# EAGLE design untitled (EAGLE 9.3.0)
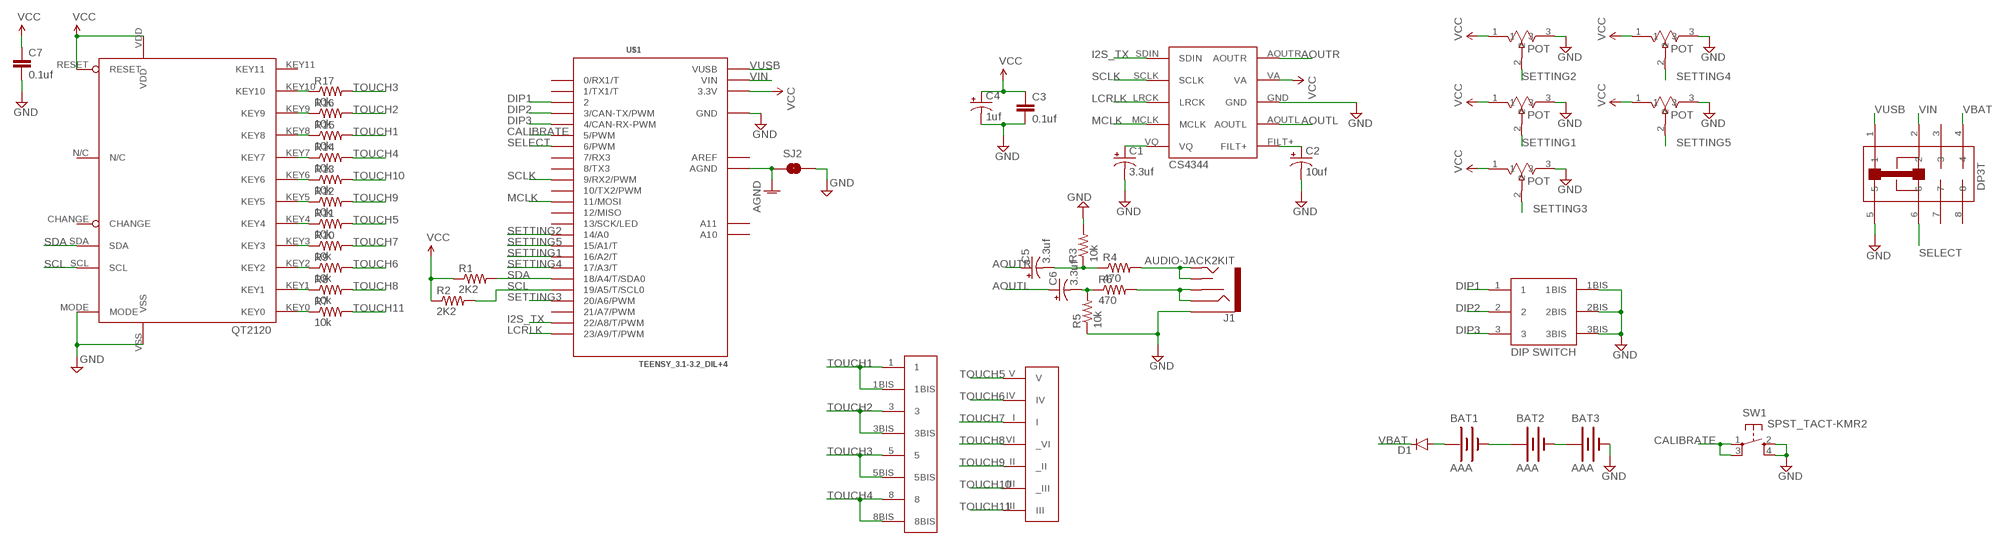
[diagram p0: schematic, sheet 1]

## Parts
BAT1  AAA  BATTERYAAA-KIT  [BATTERY-AAA-KIT]
BAT2  AAA  BATTERYAAA-KIT  [BATTERY-AAA-KIT]
BAT3  AAA  BATTERYAAA-KIT  [BATTERY-AAA-KIT]
C1  3.3uf  CAP_POL1206  [EIA3216]
C2  10uf  CAP_POL1206  [EIA3216]
C3  0.1uf  CAP1206  [1206]
C4  1uf  CAP_POL1206  [EIA3216]
C5  3.3uf  CAP_POL1206  [EIA3216]
C6  3.3uf  CAP_POL1206  [EIA3216]
C7  0.1uf  CAP1206  [1206]
D1  DIODESOD123  [SOD-123]
DIP1  SDA03H1BD  [SDA03H1BD]
DP3T1  OS203012MU5QP1  [OS203012MU5QP1]
J1  AUDIO-JACK2KIT  [AUDIO-JACK-KIT]
POT2  PTV09A-4020U-B104  [PTV09A-4020U-B104]
POT3  PTV09A-4020U-B104  [PTV09A-4020U-B104]
POT5  PTV09A-4020U-B104  [PTV09A-4020U-B104]
R1  2K2  RESISTOR1206  [1206]
R2  2K2  RESISTOR1206  [1206]
R3  10k  RESISTOR1206  [1206]
R4  470  RESISTOR1206  [1206]
R5  10k  RESISTOR1206  [1206]
R6  470  RESISTOR1206  [1206]
R7  10k  RESISTOR1206  [1206]
R8  10k  RESISTOR1206  [1206]
R9  10k  RESISTOR1206  [1206]
R10  10k  RESISTOR1206  [1206]
R11  10k  RESISTOR1206  [1206]
R12  10k  RESISTOR1206  [1206]
R13  10k  RESISTOR1206  [1206]
R14  10k  RESISTOR1206  [1206]
R15  10k  RESISTOR1206  [1206]
R16  10k  RESISTOR1206  [1206]
R17  10k  RESISTOR1206  [1206]
SJ2  JUMPER-PAD-2-NC_BY_TRACE  [PAD-JUMPER-2-NC_BY_TRACE_YES_SILK]
SW1  SPST_TACT-KMR2  [KMR2]
SWEEP  PTV09A-4020U-B104  [PTV09A-4020U-B104]
U1  CS4344  [CS4344]
U$1  TEENSY_3.1-3.2_DIL+4  [TEENSY_3.0-3.2&LC_DIL+4]
U$2  QT2120  [QT2120]
U$4  NOTEPAD  [NOTEPAD]
U$5  CHORDPAD  [CHORDPAD]
VOLUME  PTV09A-4020U-B104  [PTV09A-4020U-B104]

## Nets
AGND: SJ2.1 U$1.AGND
AOUTL: C6.A(+) U1.AOUTL
AOUTR: C5.A(+) U1.AOUTR
CALIBRATE: SW1.1(P) SW1.3(P1) U$1.5(5/PWM)
DIP1: DIP1.1 U$1.2
DIP2: DIP1.2 U$1.3(3/CAN-TX/PWM)
DIP3: DIP1.3 U$1.4(4/CAN-RX-PWM)
GND: BAT3.GND@1(-) C1.C(-) C2.C(-) C3.2 C4.C(-) C7.2 DIP1.1BIS DIP1.2BIS DIP1.3BIS DP3T1.5 J1.SLEEVE POT2.3 POT3.3 POT5.3 R3.2 R5.1 SJ2.2 SW1.2(S) SW1.4(S1) SWEEP.3 U1.GND U$1.GND U$2.MODE U$2.VSS VOLUME.3
I2S_TX: U1.SDIN U$1.22/A8(22/A8/T/PWM)
LCRLK: U1.LRCK U$1.23/A9(23/A9/T/PWM)
LEFT: J1.TIP J1.TSH R4.2
MCLK: U1.MCLK U$1.11(11/MOSI)
N$1: BAT1.GND@1(-) BAT2.PWR@1(+)
N$2: C1.A(+) U1.VQ
N$3: BAT2.GND@1(-) BAT3.PWR@1(+)
N$4: C2.A(+) U1.FILT+
N$5: C5.C(-) R3.1 R4.1
N$6: C6.C(-) R5.2 R6.1
N$7: R17.1 U$2.KEY10
N$8: R16.1 U$2.KEY9
N$9: R15.1 U$2.KEY8
N$10: R14.1 U$2.KEY7
N$11: R13.1 U$2.KEY6
N$12: R12.1 U$2.KEY5
N$13: R11.1 U$2.KEY4
N$14: R10.1 U$2.KEY3
N$15: BAT1.PWR@1(+) D1.A
N$16: R9.1 U$2.KEY2
N$17: R8.1 U$2.KEY1
N$18: R7.1 U$2.KEY0
N$24: J1.RING J1.RSH R6.2
SCL: R2.2 U$1.19/A5(19/A5/T/SCL0) U$2.SCL
SCLK: U1.SCLK U$1.9(9/RX2/PWM)
SDA: R1.2 U$1.18/A4(18/A4/T/SDA0) U$2.SDA
SELECT: DP3T1.6 U$1.6(6/PWM)
SETTING1: POT2.2 U$1.16/A2(16/A2/T)
SETTING2: U$1.14/A0 VOLUME.2
SETTING3: POT3.2 U$1.20/A6(20/A6/PWM)
SETTING4: SWEEP.2 U$1.17/A3(17/A3/T)
SETTING5: POT5.2 U$1.15/A1(15/A1/T)
TOUCH1: R15.2 U$4.1 U$4.1BIS
TOUCH2: R16.2 U$4.3 U$4.3BIS
TOUCH3: R17.2 U$4.5 U$4.5BIS
TOUCH4: R14.2 U$4.8 U$4.8BIS
TOUCH5: R11.2 U$5.V
TOUCH6: R9.2 U$5.IV
TOUCH7: R10.2 U$5.I
TOUCH8: R8.2 U$5._VI
TOUCH9: R12.2 U$5._II
TOUCH10: R13.2 U$5._III
TOUCH11: R7.2 U$5.III
VBAT: D1.C DP3T1.4
VCC: C3.1 C4.A(+) C7.1 POT2.1 POT3.1 POT5.1 R1.1 R2.1 SWEEP.1 U1.VA U$1.3.3V U$2.RESET U$2.VDD VOLUME.1
VIN: DP3T1.2 U$1.VIN
VUSB: DP3T1.1 U$1.VUSB
Unconnected: DP3T1.3 DP3T1.7 DP3T1.8 U$1.0(0/RX1/T) U$1.1(1/TX1/T) U$1.7(7/RX3) U$1.8(8/TX3) U$1.10(10/TX2/PWM) U$1.12(12/MISO) U$1.13(13/SCK/LED) U$1.21/A7(21/A7/PWM) U$1.A10 U$1.A11 U$2.CHANGE U$2.KEY11 U$2.N/C

## Power pins joined to a net without a drawn wire
AREF: U$1.AREF

## Library data of the parts
BAT1-BAT3 = SparkFun-Electromechanical:BATTERY: Battery Holders Various common sizes : AA, AAA, 18650 (PRT-12895), 20mm coin cell and 12mm coin cell. 20MM_4LEGS, BATT-10373; PROD_ID: BATT-08571
C1 C2 = SparkFun-Capacitors:CAP_POL: Capacitor Polarized These are standard SMD and PTH capacitors. Normally 10uF, 47uF, and 100uF in electrolytic and tantalum varieties. Always verify the external diameter of the through hole cap, it varies with capacity, voltage, and manufacturer. The EIA devices should be standard.
C3 C7 = SparkFun-Capacitors:CAP: Capacitor Standard 0603 ceramic capacitor, and 0.1" leaded capacitor.
C4-C6 = SparkFun-Passives:CAP_POL: Capacitor Polarized These are standard SMD and PTH capacitors. Normally 10uF, 47uF, and 100uF in electrolytic and tantalum varieties. Always verify the external diameter of the through hole cap, it varies with capacity, voltage, and manufacturer. The EIA devices should be standard.
D1 = SparkFun-DiscreteSemi:DIODE: Diode These are standard reverse protection diodes and small signal diodes. SMA package can handle up to about 1A. SOD-323 can handle about 200mA. What the SOD-323 package when ordering, there are some mfgs out there that are 5-pin packages.
DIP1 = synthetica:SDA03H1BD
DP3T1 = synthetica:OS203012MU5QP1: A DP3T SWITCH. 3 position, one common out for two rows
J1 = SparkFun-Connectors:AUDIO-JACK2: Stereo audio jack with bypass switches. SMT version used on LilyPad MP3 board.; PROD_ID: CONN-08774
POT2 POT3 POT5 SWEEP VOLUME = synthetica:PTV09A-4020U-B104
R1-R17 = SparkFun-Passives:RESISTOR: Resistor Basic schematic elements and footprints for 0603, 1206, and PTH resistors.
SJ2 = SparkFun-Passives:JUMPER-PAD-2-NC_BY_TRACE
SW1 = adafruit:SPST_TACT: SMT 6mm switch, EVQQ2 series http://www.ladyada.net/library/eagle
U1 = synthetica:CS4344
U$1 = Teensy_3_and_LC_Series_Boards_v1.4:TEENSY_3.1-3.2_DIL+4: Teensy 3.1 and 3.2 in a DIL package with the inner 4 pins
U$2 = synthetica:QT2120
U$4 = synthetica:NOTEPAD
U$5 = synthetica:CHORDPAD

## Board
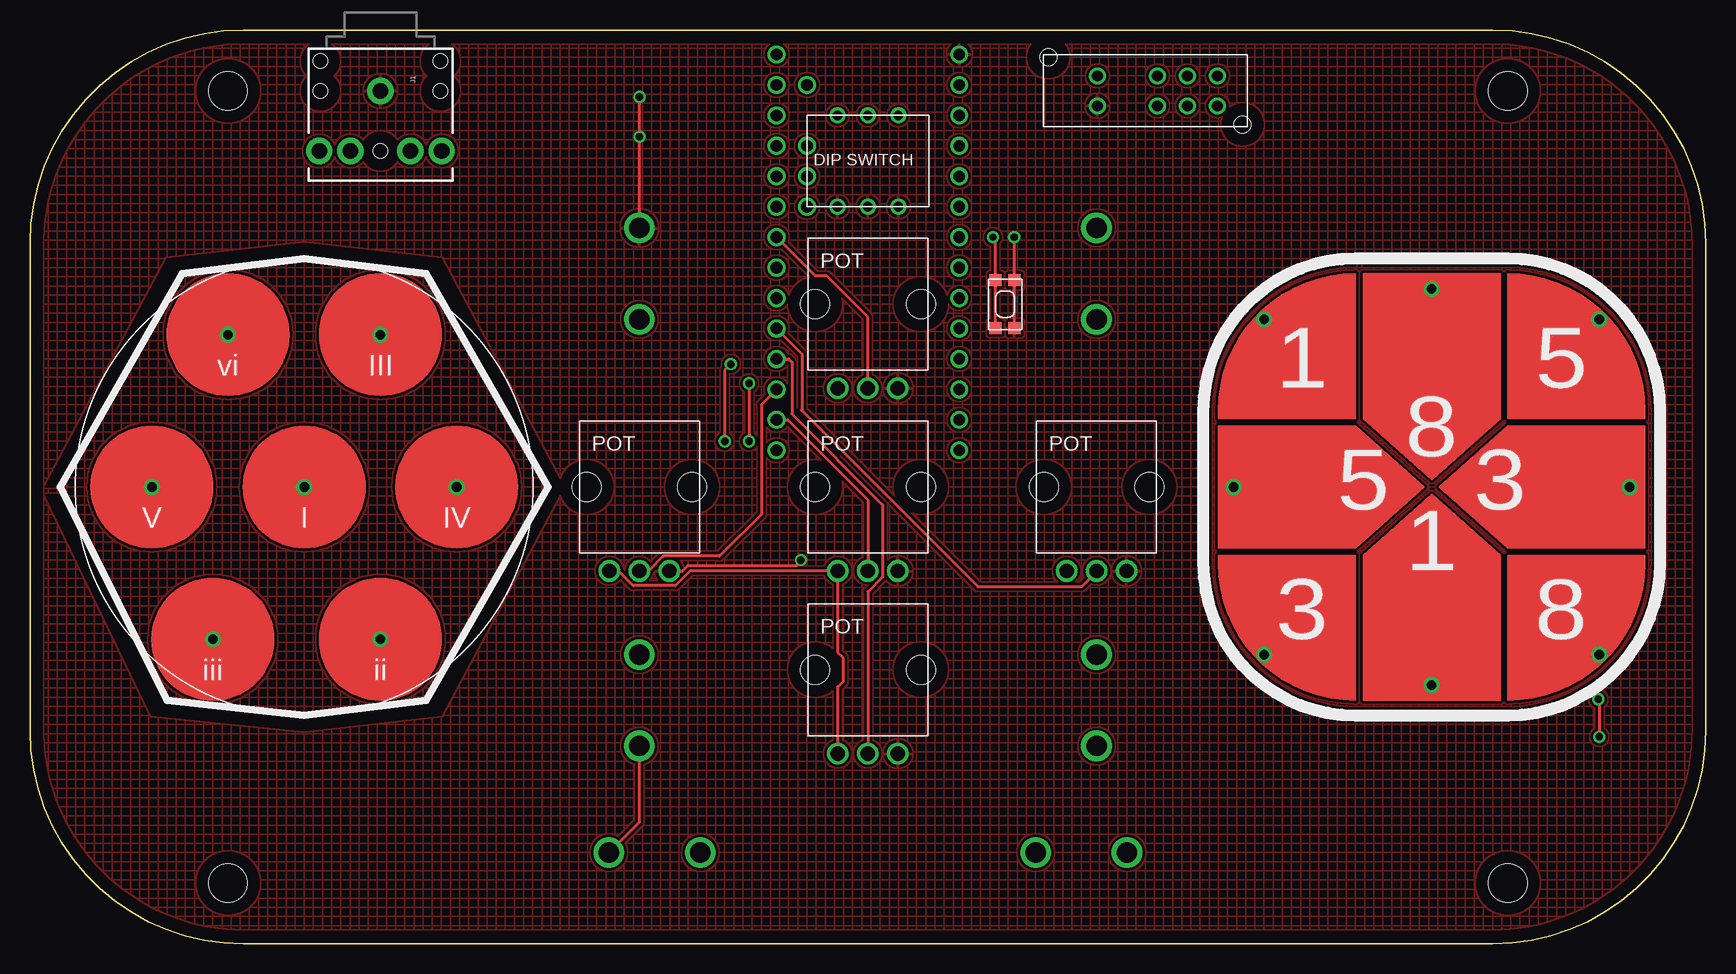
[diagram p1: board, top side]
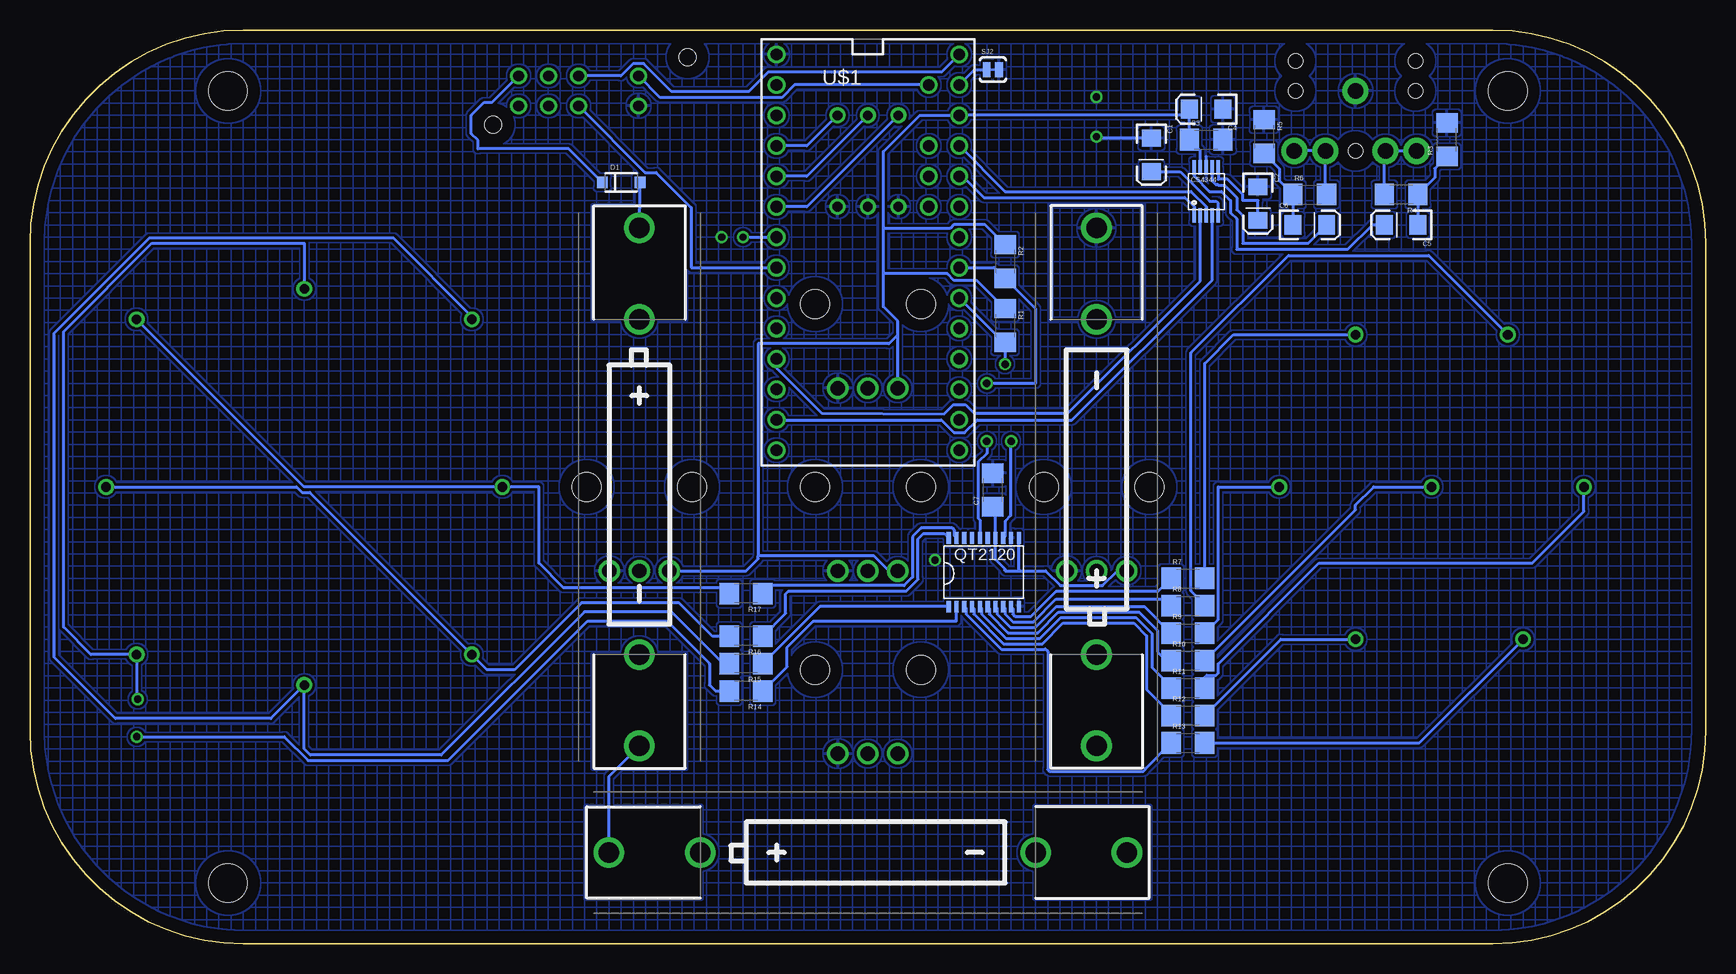
[diagram p2: board, bottom side, seen from below]

Size 139.7 x 76.2 mm. Coordinates in mm from the lower left corner, seen from the top.
Outline: 0,58.42 arc-90 17.78,76.2 121.92,76.2 arc-90 139.7,58.42 139.7,17.78 arc-90 121.92,0 17.78,0 arc-90 0,17.78 0,58.42
Copper layers (1*16): Top 0.035mm / dielectric 1.5mm / Bottom 0.035mm
Design rules "default": minimum track width 10mil, minimum drill 24mil, track to track 8mil, track to pad 8mil, pad to pad 8mil, via to via 8mil, smd to smd 8mil, copper to edge 40mil, drill to drill 8mil, minimum pad ring 10mil, minimum via ring 8mil, stop-mask expansion 4mil, vias tented up to drill 0mil, thermal gap 10mil
Holes 3.2 mm at 16.51,71.12 16.51,5.08 123.19,71.12 123.19,5.08

### Footprints (pad centres in the part's own frame; a part is rotated, then mirrored left to right if it is on the bottom)
BATTERY-AAA-KIT = drill 1.702: GND@1 21.59,0; GND@2 13.97,0; PWR@1 -21.59,0; PWR@2 -13.97,0
EIA3216 = smd 1.4 x 1.6: A 1.4,0; C -1.4,0
1206 = smd 1.6 x 1.8: 1 -1.4,0; 2 1.4,0
SOD-123 = smd 0.9 x 0.95: A 1.575,0; C -1.575,0
SDA03H1BD = drill 0.8: 1 -2.54,-3.81; 1BIS -2.54,3.81; 2 0,-3.81; 2BIS 0,3.81; 3 2.54,-3.81; 3BIS 2.54,3.81
OS203012MU5QP1 = drill 0.9: 1 -5,1.25; 2 0,1.25; 3 2.5,1.25; 4 5,1.25; 5 -5,-1.25; 6 0,-1.25; 7 2.5,-1.25; 8 5,-1.25 | hole 1.4: -9.1,2.8; 7.1,-2.8
AUDIO-JACK-KIT = drill 1.3 pad 2.184: RING 5,5.1; RSH 5,2.5; SLEEVE 0,0; TIP 5,-5.1; TSH 5,-2.5 | hole 1.2: 0,5; -2.5,5; -2.5,-5; 0,-5; 5,0
PTV09A-4020U-B104 = drill 1.2: 1 -2.5,-7; 2 0,-7; 3 2.5,-7 | hole 2.4: -4.4,0; 4.4,0
PAD-JUMPER-2-NC_BY_TRACE_YES_SILK = smd 0.635 x 1.27: 1 -0.508,0; 2 0.508,0
KMR2 = smd 1 x 1: 1 2,0.8; 2 2,-0.8; 3 -2,0.8; 4 -2,-0.8
CS4344 = smd 0.3 x 1.2: AOUTL 0.5,2; AOUTR -1,2; FILT+ 1,2; GND 0,2; LRCK 0,-2; MCLK 0.5,-2; SCLK -0.5,-2; SDIN -1,-2; VA -0.5,2; VQ 1,-2
TEENSY_3.0-3.2&LC_DIL+4 = drill 0.965: 0 -7.62,13.97; 1 -7.62,11.43; 2 -7.62,8.89; 3 -7.62,6.35; 3.3V 7.62,11.43; 4 -7.62,3.81; 5 -7.62,1.27; 6 -7.62,-1.27; 7 -7.62,-3.81; 8 -7.62,-6.35; 9 -7.62,-8.89; 10 -7.62,-11.43; 11 -7.62,-13.97; 12 -7.62,-16.51; 13 7.62,-16.51; 14/A0 7.62,-13.97; 15/A1 7.62,-11.43; 16/A2 7.62,-8.89; 17/A3 7.62,-6.35; 18/A4 7.62,-3.81; 19/A5 7.62,-1.27; 20/A6 7.62,1.27; 21/A7 7.62,3.81; 22/A8 7.62,6.35; 23/A9 7.62,8.89; A10 5.08,6.35; A11 5.08,3.81; AGND 7.62,13.97; AREF 5.08,8.89; GND -7.62,16.51; VIN 7.62,16.51; VUSB 5.08,13.97
QT2120 = smd 0.35 x 0.97: CHANGE -0.975,2.86; KEY0 2.275,-2.86; KEY1 1.625,-2.86; KEY2 0.975,-2.86; KEY3 0.325,-2.86; KEY4 -0.325,-2.86; KEY5 -0.975,-2.86; KEY6 -1.625,-2.86; KEY7 -2.275,-2.86; KEY8 -2.925,-2.86; KEY9 -2.925,2.86; KEY10 -2.275,2.86; KEY11 -1.625,2.86; MODE 2.275,2.86; N/C 0.325,2.86; RESET 0.975,2.86; SCL -0.325,2.86; SDA 1.625,2.86; VDD 2.925,2.86; VSS 2.925,-2.86
NOTEPAD = drill 0.8: 1 0,-16.51; 1BIS -13.97,13.97; 3 16.51,0; 3BIS -13.97,-13.97; 5 -16.51,0; 5BIS 13.97,13.97; 8 0,16.51; 8BIS 13.97,-13.97
CHORDPAD = drill 0.8: _II 6.35,-12.7; _III -7.62,-12.7; _VI -6.35,12.7; I 0,0; III 6.35,12.7; IV 12.7,0; V -12.7,0

### Placement (x,y rotation side)
BAT1  88.9,38.1 270 bottom
BAT2  69.85,7.62 0 bottom
BAT3  50.8,38.1 90 bottom
C1  46.23,65.79 270 bottom
C2  37.34,61.72 270 bottom
C3  41.66,67.06 0 bottom
C4  41.66,69.6 180 bottom
C5  25.4,59.94 180 bottom
C6  33.02,59.94 0 bottom
C7  59.44,37.85 90 bottom
D1  90.42,63.5 0 bottom
DIP1  69.85,65.28 180 top
DP3T1  93.98,71.12 0 top
J1  29.21,71.12 270 top
POT2  69.85,22.86 0 top
POT3  69.85,53.34 0 top
POT5  50.8,38.1 0 top
R1  58.42,51.56 270 bottom
R2  58.42,56.9 270 bottom
R3  21.59,67.06 90 bottom
R4  25.4,62.48 180 bottom
R5  36.83,67.31 270 bottom
R6  33.02,62.48 0 bottom
R7  43.18,30.48 0 bottom
R8  43.18,28.19 0 bottom
R9  43.18,25.91 0 bottom
R10  43.18,23.62 0 bottom
R11  43.18,21.34 0 bottom
R12  43.18,19.05 0 bottom
R13  43.18,16.76 0 bottom
R14  80.01,21.08 180 bottom
R15  80.01,23.37 180 bottom
R16  80.01,25.65 180 bottom
R17  80.01,29.21 180 bottom
SJ2  59.44,72.9 0 bottom
SW1  81.28,53.34 90 top
SWEEP  88.9,38.1 0 top
U1  41.66,62.74 0 bottom
U$1  69.85,57.66 0 bottom
U$2  60.2,30.99 0 bottom
U$4  116.84,38.1 0 top
U$5  22.86,38.1 0 top
VOLUME  69.85,38.1 0 top

### Tracks (layer width: path | path; a pad name or v marks a point on that pad's centre or on a via)
AGND
  Bottom 0.254: 61.98,71.63 U$1.AGND 60.96,72.9 SJ2.1
AOUTL
  Bottom 0.254: C6.A 33.14,58.42 38.61,58.42 38.61,60.71 39.12,61.21 39.12,62.23 40.13,63.25 40.64,63.25 40.69,63.3 40.84,63.3 41.14,63.59 41.14,64.72 U1.AOUTL
AOUTR
  Bottom 0.254: U1.AOUTR 42.66,64.02 41.37,62.74 40.39,62.74 39.62,61.98 39.62,60.96 39.12,60.45 39.12,57.91 29.85,57.91 27.82,59.94 C5.A
CALIBRATE  (via drill 0.61)
  Top 0.254: v80.26,58.93 80.48,58.71 SW1.1 SW1.3
  Bottom 0.254: v80.26,58.93 U$1.5
DIP1
  Bottom 0.254: DIP1.1 74.93,66.55 U$1.2
DIP2
  Bottom 0.254: DIP1.2 74.93,64.01 U$1.3
DIP3
  Bottom 0.254: DIP1.3 74.93,61.47 U$1.4
GND  (via drill 0.61)
  Top 0.254: v50.8,70.61 v50.8,67.31 BAT3.GND@1 | SW1.4 SW1.2 82.04,55.38 v82.04,58.93 | POT5.3 54.39,31.1 54.85,31.56 63.95,31.56 64.26,31.87 v64.26,32
  Bottom 0.254: U1.GND 41.66,65.66 | R5.1 36.7,68.58 | C1.C 50.68,67.19 v50.8,67.31
  pour Top (hatched): 0,58.42 arc-90 17.78,76.2 121.92,76.2 arc-90 139.7,58.42 139.7,17.78 arc-90 121.92,0 22.86,0 17.78,0 arc-90 0,17.78
  pour Bottom (hatched): 0,57.15 0,57.15 0,58.42 arc-90 17.78,76.2 121.92,76.2 arc-90 139.7,58.42 139.7,17.78 arc-90 121.92,0 17.78,0 arc-90 0,17.78
I2S_TX
  Bottom 0.254: U$1.22/A8 61.98,64.01 60.2,62.23 43.43,62.23 42.66,61.45 U1.SDIN
LCRLK
  Bottom 0.254: U$1.23/A9 58.42,62.74 42.93,62.74 41.66,61.47 U1.LRCK
LEFT
  Bottom 0.254: R4.2 26.8,66.03 J1.TSH J1.TIP
MCLK
  Bottom 0.254: U$1.11 63.74,43.69 62.67,42.62 61.79,42.62 60.72,43.69 52.83,43.69 41.16,55.36 U1.MCLK
N$1
  Bottom 0.254: BAT2.PWR@1 91.44,13.97 BAT1.GND@1
N$2
  Bottom 0.254: C1.A 43.81,64.39 41.35,61.92 40.82,61.92 40.66,61.75 U1.VQ
N$3
  Top 0.254: BAT2.GND@1 50.8,10.16 BAT3.PWR@1
N$4
  Bottom 0.254: U1.FILT+ 40.66,63.75 39.88,63.75 38.61,62.48 38.61,61.98 37.34,61.98 C2.A
N$5
  Bottom 0.254: C5.C R4.1 22.61,63.88 22.61,64.64 R3.1
N$6
  Bottom 0.254: C6.C R6.1 35.56,63.62 35.56,64.64 R5.2
N$7
  Bottom 0.254: U$2.KEY10 62.62,33.99 62.62,34.47 62.81,34.66 65.42,34.66 66.12,33.97 66.12,30.59 66.84,29.87 77.95,29.87 R17.1
N$8
  Bottom 0.254: R16.1 76.71,27.56 76.71,29.2 76.49,29.41 66.65,29.41 65.66,30.4 65.66,33.78 65.23,34.21 63.48,34.21 U$2.KEY9
N$9
  Bottom 0.254: U$2.KEY8 73.85,28.13 R15.1
N$10
  Bottom 0.254: R14.1 76.59,23.1 76.59,24.74 74.41,26.92 62.48,26.92 62.47,26.93 U$2.KEY7
N$11
  Bottom 0.254: U$2.KEY6 61.68,27.98 61.68,27.51 58.74,24.57 55.12,24.57 55.08,24.6 54.86,24.38 54.86,14.55 54.72,14.4 46.88,14.4 46.74,14.55 46.74,14.61 R13.1
N$12
  Bottom 0.254: U$2.KEY5 61.03,27.98 61.03,27.51 58.55,25.03 55.31,25.03 53.58,26.76 47.69,26.76 46.62,25.69 46.62,21.21 44.58,19.17 R12.1
N$13
  Bottom 0.254: U$2.KEY4 60.38,27.98 60.38,27.51 58.36,25.48 55.5,25.48 53.77,27.21 47.5,27.21 46.17,25.88 46.17,23.04 44.58,21.45 R11.1
N$14
  Bottom 0.254: U$2.KEY3 59.73,27.98 59.73,27.51 58.16,25.94 55.69,25.94 53.95,27.67 47.24,27.67 45.71,26.14 45.71,24.36 44.97,23.62 R10.1
N$15
  Bottom 0.254: BAT1.PWR@1 88.9,61.29 88.85,61.34 D1.A
N$16
  Bottom 0.254: R9.1 46.8,28.13 54.15,28.13 55.87,26.4 57.97,26.4 59.08,27.51 59.08,27.98 U$2.KEY2
N$17
  Bottom 0.254: U$2.KEY1 58.43,27.98 58.43,27.51 57.78,26.86 56.06,26.86 54.16,28.76 45.15,28.76 R8.1
N$18
  Bottom 0.254: U$2.KEY0 57.78,27.98 57.78,27.51 57.59,27.31 56.25,27.31 54.15,29.41 45.65,29.41 R7.1
N$24
  Bottom 0.254: R6.2 31.71,62.57 J1.RSH J1.RING
SCL  (via drill 0.61)
  Top 0.254: v59.94,46.74 v59.94,41.91
  Bottom 0.254: U$1.19/A5 59.31,56.39 R2.2 55.88,52.96 55.88,46.74 v59.94,46.74 | v59.94,41.91 59.94,40.91 60.67,40.18 60.67,35.51 60.52,35.37 U$2.SCL
SCLK
  Bottom 0.254: U$1.9 77.47,48.01 73.71,44.25 63.5,44.2 62.74,44.96 61.72,44.96 61.01,44.25 53.18,44.25 42.16,55.27 U1.SCLK
SDA  (via drill 0.61)
  Top 0.254: v58.42,48.34 57.91,47.83 v57.91,41.91
  Bottom 0.254: U$1.18/A4 58.54,50.16 R1.2 v58.42,48.34 | U$2.SDA 58.43,33.99 58.43,35.23 57.95,35.71 57.95,41.62 57.91,41.66 v57.91,41.91
SELECT
  Bottom 0.254: DP3T1.6 88.42,64.31 87.49,64.31 84.58,61.4 84.58,56.39 U$1.6
SETTING1
  Top 0.254: POT2.2 69.85,29.36 71.08,30.59 71.08,36.62 63.5,44.2 63.5,48.51 63.25,48.77 U$1.16/A2
SETTING2
  Top 0.254: U$1.14/A0 63.18,43.69 69.85,37.01 VOLUME.2
SETTING3
  Top 0.254: U$1.20/A6 65.47,55.68 66.42,55.68 69.85,52.25 POT3.2
SETTING4
  Top 0.254: U$1.17/A3 64.34,49.2 64.34,44.56 64.39,44.51 64.3,44.51 79.02,29.79 87.67,29.79 88.9,31.02 SWEEP.2
SETTING5
  Top 0.254: U$1.15/A1 60.96,44.96 60.96,35.81 57.48,32.33 52.79,32.33 51.56,31.1 POT5.2
TOUCH1
  Bottom 0.254: U$4.1BIS 102.87,52.32 109.42,58.88 129.73,58.88 137.67,50.94 137.67,23.88 132.59,18.8 119.63,18.8 U$4.1 116.84,16.26 116.33,15.75 105.41,15.75 93.47,27.69 86.24,27.69 81.92,23.37 R15.2
TOUCH2
  Bottom 0.254: U$4.3 117.49,38.1 117.03,37.64 116.38,37.64 U$4.3BIS 101.6,22.86 99.31,22.86 93.73,28.45 85.6,28.45 82.8,25.65 R16.2
TOUCH3
  Bottom 0.254: U$4.5BIS 116.84,38.1 U$4.5 97.28,38.1 97.28,31.75 95.25,29.72 81.92,29.72 R17.2
TOUCH4  (via drill 0.61)
  Top 0.254: v130.72,20.41 130.81,20.32 v130.81,17.27
  Bottom 0.254: U$4.8 116.84,58.42 129.54,58.42 136.91,51.05 136.91,26.42 134.62,24.13 U$4.8BIS 130.81,20.32 v130.72,20.41 | v130.81,17.27 118.5,17.27 116.52,15.29 104.85,15.29 93.22,26.92 86.61,26.92 83.06,23.37 83.06,21.59 82.55,21.08 R14.2
TOUCH5
  Bottom 0.254: R11.2 41.78,22.23 41.62,22.39 40.84,22.39 40.65,22.59 40.65,23.36 32.26,31.75 14.48,31.75 10.16,36.07 U$5.V
TOUCH6
  Bottom 0.254: R9.2 40.64,27.05 40.64,38.1 U$5.IV
TOUCH7
  Bottom 0.254: R10.2 29.21,36.19 29.21,36.58 27.69,38.1 U$5.I
TOUCH8
  Bottom 0.254: R8.2 41.78,28.31 42.91,29.44 42.91,49.29 34.8,57.4 23.11,57.4 U$5._VI
TOUCH9
  Bottom 0.254: R12.2 35.43,25.4 U$5._II
TOUCH10
  Bottom 0.254: R13.2 23.88,16.76 U$5._III
TOUCH11
  Bottom 0.254: R7.2 41.78,48.39 39.37,50.8 U$5.III
VBAT
  Bottom 0.254: D1.C 94.79,66.29 102.36,66.29 102.36,67 102.92,67.56 102.92,69.08 101.84,70.16 101.19,70.16 DP3T1.4
VCC
  Top 0.254: POT2.1 67.35,21.45 67.79,21.89 67.79,23.83 67.35,24.27 VOLUME.1 55.04,31.1 53.81,29.87 50.29,29.87 49.06,31.1 POT5.1
  Bottom 0.254: U1.VA 42.16,66.16 C3.1 C4.A 43.56,69.09 U$1.3.3V 65.53,69.09 68.56,66.06 68.56,59.69 | VOLUME.1 68.11,31.1 69.34,32.33 78.99,32.33 | POT3.1 67.35,50.8 | 67.35,50.8 67.35,51.93 68.56,53.13 68.56,55.88 | 68.56,55.88 68.56,59.69 | SWEEP.1 80.01,31.1 78.99,32.12 78.99,32.33 | 67.35,50.8 68.11,50.04 78.99,50.04 78.99,32.33 | 57.15,31.1 58.42,31.1 58.42,31.24 59.22,32.05 U$2.RESET 59.22,36.23 C7.1 | 57.15,31.1 55.04,31.1 53.81,29.87 50.29,29.87 49.06,31.1 POT5.1 | 57.15,31.1 57.27,31.22 U$2.VDD | 68.56,59.69 62.98,59.69 62.67,59.99 60.12,59.99 R2.1 | 57.79,53.59 R1.1 60.78,55.32 62.67,55.32 63.23,55.88 68.56,55.88
VIN
  Bottom 0.254: U$1.VIN 63.7,72.69 78.17,72.69 79.8,71.06 86.21,71.06 88.55,73.4 89.41,73.4 90.44,72.37 DP3T1.2
VUSB
  Bottom 0.254: U$1.VUSB 75.96,71.63 77.03,70.56 87.17,70.56 DP3T1.1